# Altium schematic sheet Sheet2.SchDoc
size A3
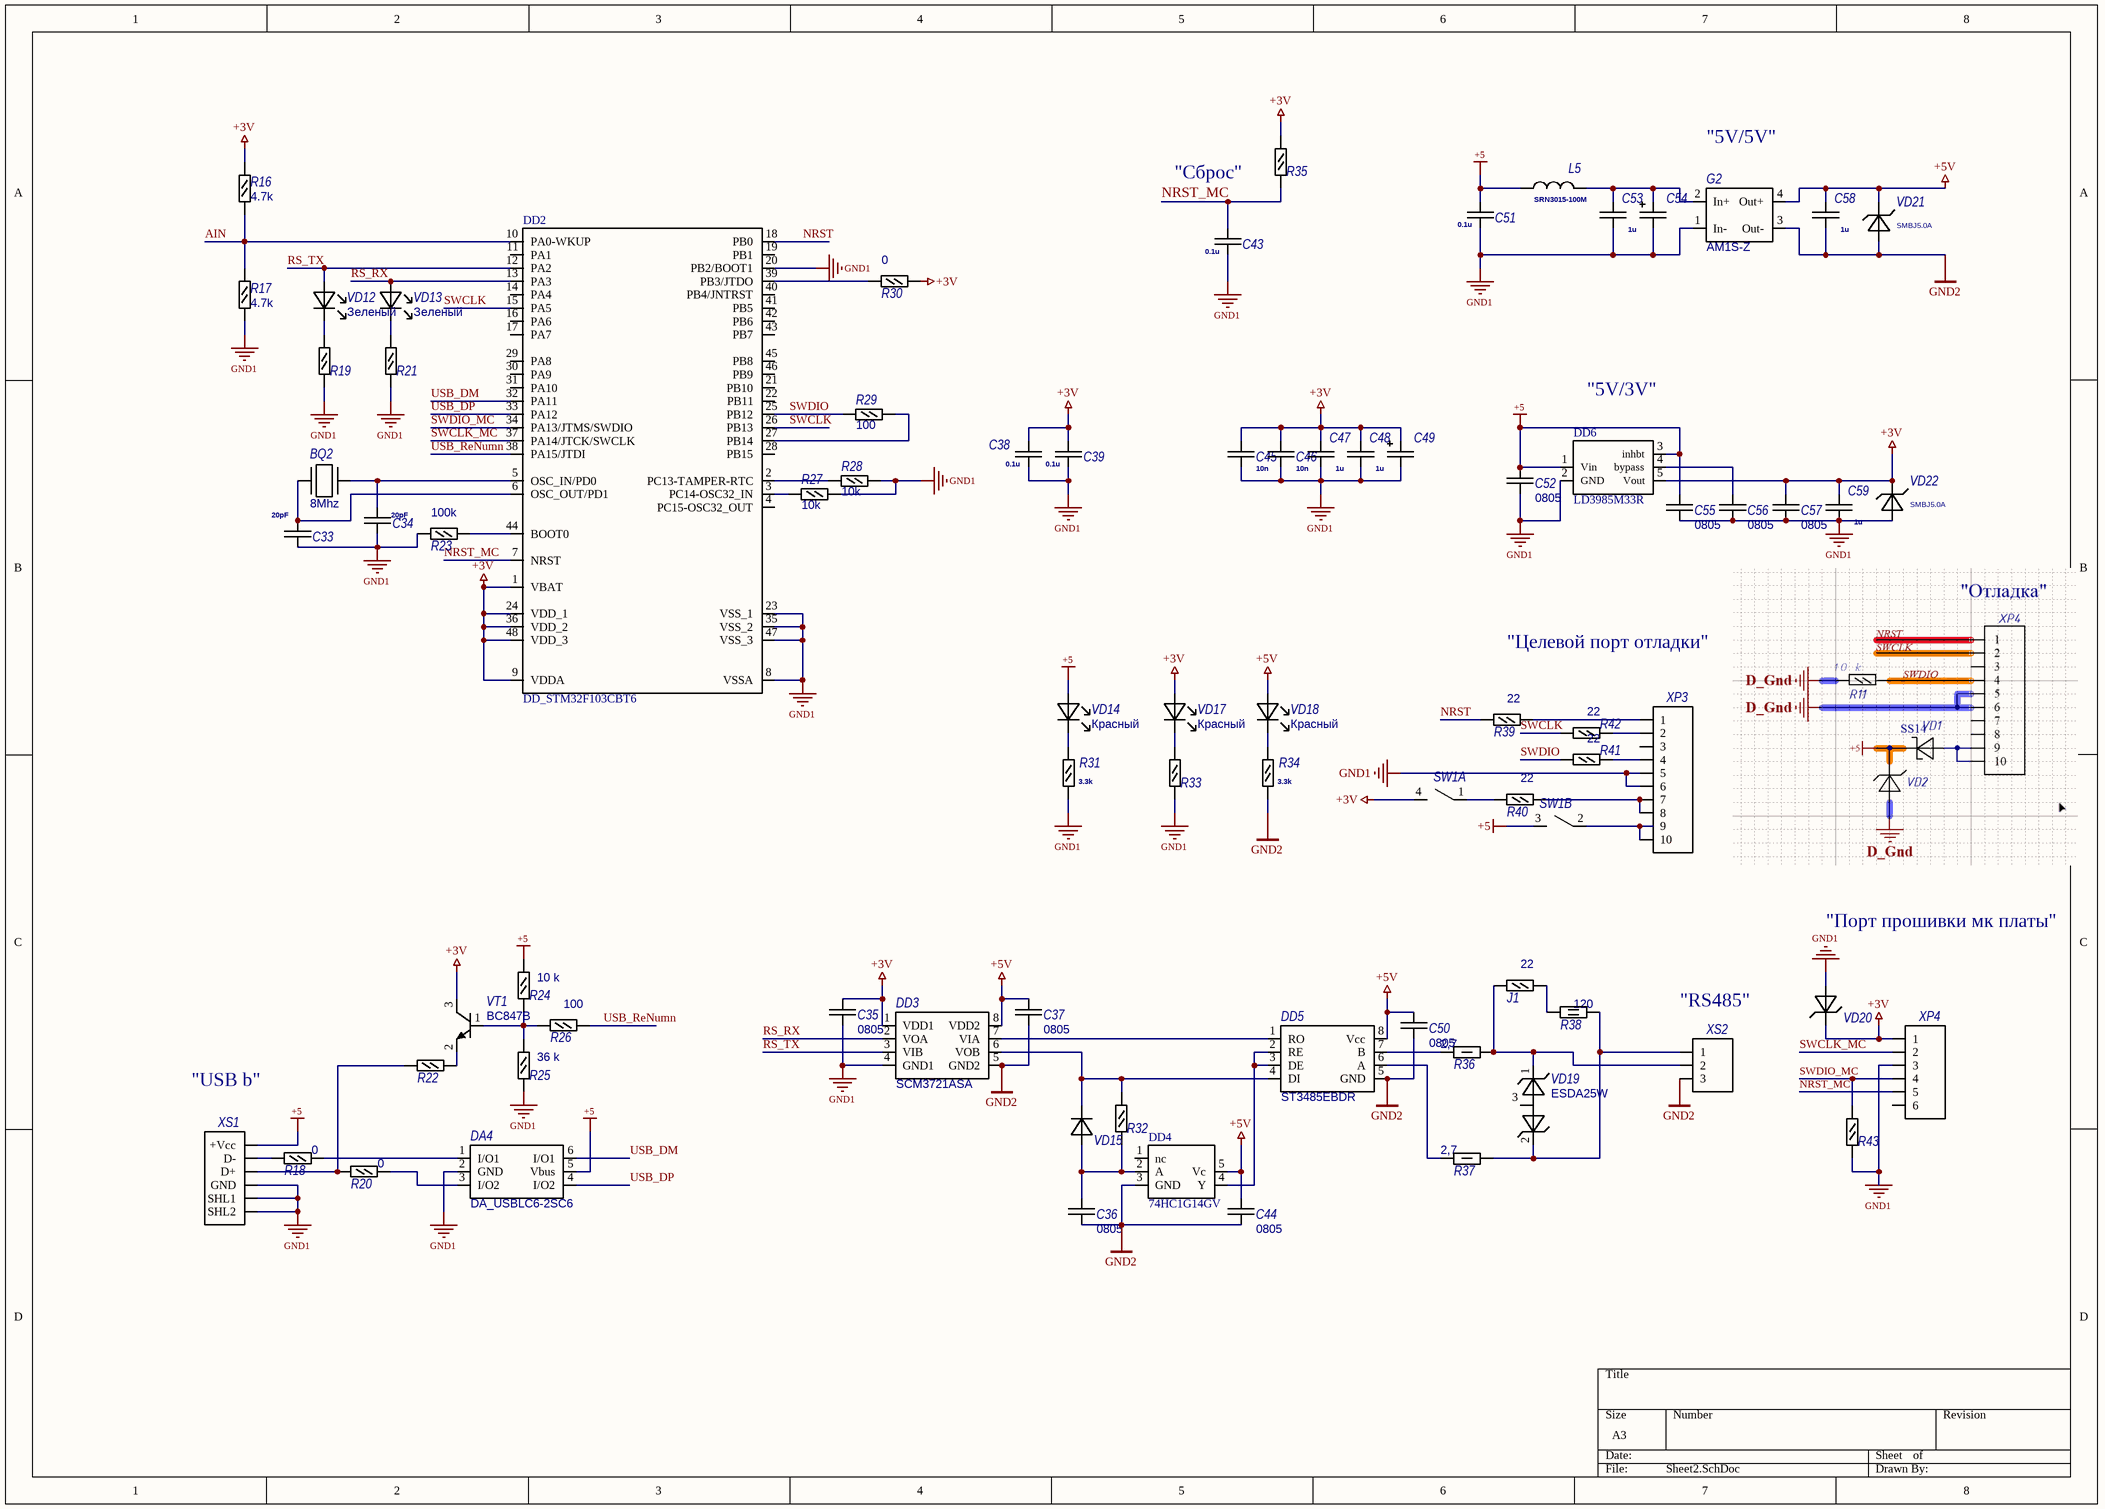
[diagram p0: Sheet2.SchDoc]

## Parts
BQ2  8Mhz  [Xtal]
C33  Номинал: 20pF  [CAP_0805_(2x1.25x1.3)]
C34  Номинал: 20pF  [CAP_0805_(2x1.25x1.3)]
C35  0805  [CAP_0805_(2x1.25x1.3)]
C36  0805  [CAP_0805_(2x1.25x1.3)]
C37  0805  [CAP_0805_(2x1.25x1.3)]
C38  0.1u  [CAP_0805_(2x1.25x1.3)]
C39  0.1u  [CAP_0805_(2x1.25x1.3)]
C43  0.1u  [CAP_0805_(2x1.25x1.3)]
C44  0805  [CAP_0805_(2x1.25x1.3)]
C45  10n  [CAP_0805_(2x1.25x1.3)]
C46  10n  [CAP_0805_(2x1.25x1.3)]
C47  1u  [CAP_0805_(2x1.25x1.3)]
C48  1u  [CAP_0805_(2x1.25x1.3)]
C49  TAN_A  [CAP_TAN_B]  (value not drawn)
C50  0805  [CAP_0805_(2x1.25x1.3)]
C51  0.1u  [CAP_0805_(2x1.25x1.3)]
C52  0805  [CAP_0805_(2x1.25x1.3)]
C53  1u  [CAP_0805_(2x1.25x1.3)]
C54  TAN_A  [CAP_TAN_B]  (value not drawn)
C55  0805  [CAP_0805_(2x1.25x1.3)]
C56  0805  [CAP_0805_(2x1.25x1.3)]
C57  0805  [CAP_0805_(2x1.25x1.3)]
C58  1u  [CAP_0805_(2x1.25x1.3)]
C59  1u  [CAP_0805_(2x1.25x1.3)]
DA4  DA_USBLC6-2SC6  [SOT-23-6L]
DD2  DD_STM32F103CBT6  [LQFP_48]
DD3  SCM3721ASA  [SOP-8]
DD4  74HC1G14GV  [sot-23-5]
DD5  ST3485EBDR  [SO-8_(0.15')]
DD6  LD3985M33R  [sot-23-5]
G2  AM1S-Z  [AM1S-Z]
J1  Номинал: 22  [RES_0805_(2x1.2x0.45)_0.125Вт]  (hidden comment: 0805)
L5  SRN3015-100M  [L_SRN3015]
R16  Номинал: 4.7k  [RES_0805_(2x1.2x0.45)_0.125Вт]  (hidden comment: 0805)
R17  Номинал: 4.7k  [RES_0805_(2x1.2x0.45)_0.125Вт]  (hidden comment: 0805)
R18  Номинал: 0  [RES_0805_(2x1.2x0.45)_0.125Вт]  (hidden comment: 0805)
R19  0805  [RES_0805_(2x1.2x0.45)_0.125Вт]  (value not drawn)
R20  Номинал: 0  [RES_0805_(2x1.2x0.45)_0.125Вт]  (hidden comment: 0805)
R21  0805  [RES_0805_(2x1.2x0.45)_0.125Вт]  (value not drawn)
R22  0805  [RES_0805_(2x1.2x0.45)_0.125Вт]  (value not drawn)
R23  Номинал: 100k  [RES_0805_(2x1.2x0.45)_0.125Вт]  (hidden comment: 0805)
R24  Номинал: 10 k  [RES_0805_(2x1.2x0.45)_0.125Вт]  (hidden comment: 0805)
R25  Номинал: 36 k  [RES_0805_(2x1.2x0.45)_0.125Вт]  (hidden comment: 0805)
R26  Номинал: 100  [RES_0805_(2x1.2x0.45)_0.125Вт]  (hidden comment: 0805)
R27  Номинал: 10k  [RES_0805_(2x1.2x0.45)_0.125Вт]  (hidden comment: 0805)
R28  Номинал: 10k  [RES_0805_(2x1.2x0.45)_0.125Вт]  (hidden comment: 0805)
R29  Номинал: 100  [RES_0805_(2x1.2x0.45)_0.125Вт]  (hidden comment: 0805)
R30  Номинал: 0  [RES_0805_(2x1.2x0.45)_0.125Вт]  (hidden comment: 0805)
R31  3.3k  [RES_0805_(2x1.2x0.45)_0.125Вт]
R32  0805  [RES_0805_(2x1.2x0.45)_0.125Вт]  (value not drawn)
R33  0805  [RES_0805_(2x1.2x0.45)_0.125Вт]  (value not drawn)
R34  3.3k  [RES_0805_(2x1.2x0.45)_0.125Вт]
R35  0805  [RES_0805_(2x1.2x0.45)_0.125Вт]  (value not drawn)
R36  Номинал: 2,7  [RES_1210_(3.2x2.5x0.55)_0.5Вт]  (hidden comment: 1210)
R37  Номинал: 2,7  [RES_1210_(3.2x2.5x0.55)_0.5Вт]  (hidden comment: 1210)
R38  Номинал: 120  [RES_2512_(6.3x3.1x0.6)_2Вт]  (hidden comment: 2512)
R39  Номинал: 22  [RES_0805_(2x1.2x0.45)_0.125Вт]  (hidden comment: 0805)
R40  Номинал: 22  [RES_0805_(2x1.2x0.45)_0.125Вт]  (hidden comment: 0805)
R41  Номинал: 22  [RES_0805_(2x1.2x0.45)_0.125Вт]  (hidden comment: 0805)
R42  Номинал: 22  [RES_0805_(2x1.2x0.45)_0.125Вт]  (hidden comment: 0805)
R43  0805  [RES_0805_(2x1.2x0.45)_0.125Вт]  (value not drawn)
SW1  SW_2_pin  [SW_DS1040_2pin]  (value not drawn)  (parts A,B of 2)
VD12  Примечания: Зеленый  [led_0805]  (hidden comment: VD_Led_0805)
VD13  Примечания: Зеленый  [led_0805]  (hidden comment: VD_Led_0805)
VD14  Примечания: Красный  [led_0805]  (hidden comment: VD_Led_0805)
VD15  VD  [VD_SMA_(Do-214AC)]  (value not drawn)
VD17  Примечания: Красный  [led_0805]  (hidden comment: VD_Led_0805)
VD18  Примечания: Красный  [led_0805]  (hidden comment: VD_Led_0805)
VD19  ESDA25W  [SOT-323-3L]
VD20  ESD  [VD_SOD523]  (value not drawn)
VD21  SMBJ5.0A  [VD_SMB_(Do-214AA)]
VD22  SMBJ5.0A  [VD_SMB_(Do-214AA)]
VT1  BC847B  [SOT-23]
XP3  XP_5x2_H  [XP_5x2_PIN_H]  (value not drawn)
XP4  XP_6_pin  [XP_6_Pin]  (value not drawn)
XS1  XS_USB_B  [XS_USBB]  (value not drawn)
XS2  XS_3_pin_2.54  [XS_KLS-2.54-03P]  (value not drawn)

## Nets
+3V: C35.2 C38.2 C39.2 C45.1 C46.1 C47.1 C48.1 C49.1 C57.2 C59.1 DD2.1(VBAT) DD2.9(VDDA) DD2.24(VDD_1) DD2.36(VDD_2) DD2.48(VDD_3) DD3.1(VDD1) DD6.5(Vout) R16.2 R30.1 R35.1 SW1.4 VD17.1(A) VD20.2(K) VD22.2(K) VT1.3(C) XP4.1
+5: C51.2 C52.2 C55.2 DA4.5(Vbus) DD6.1(Vin) DD6.3(inhbt) L5.1 R24.2 SW1.3 VD14.1(A) XS1.1(+Vcc)
+5V: C37.2 C44.2 C50.2 C58.1 DD3.8(VDD2) DD4.5(Vc) DD5.8(Vcc) G2.4(Out+) VD18.1(A) VD21.2(K)
GND1: C33.1 C34.1 C35.1 C38.1 C39.1 C43.1 C45.2 C46.2 C47.2 C48.2 C49.2 C51.1 C52.1 C53.2 C54.2 C55.1 C56.1 C57.1 C59.2 DA4.2(GND) DD2.8(VSSA) DD2.20(PB2/BOOT1) DD2.23(VSS_1) DD2.35(VSS_2) DD2.47(VSS_3) DD3.4(GND1) DD6.2(GND) G2.1(In-) R17.1 R19.1 R21.1 R23.2 R25.1 R27.2 R28.2 R31.1 R33.1 R43.2 VD20.1(A) VD22.1(A) XP3.5 XP3.6 XP4.3 XS1.4(GND) XS1.5(SHL1) XS1.6(SHL2)
GND2: C36.1 C37.1 C44.1 C50.1 C58.2 DD3.5(GND2) DD4.3(GND) DD5.5(GND) G2.3(Out-) R34.1 VD21.1(A) XS2.3
AIN: DD2.10(PA0-WKUP) R16.1 R17.2
NRST: DD2.18(PB0) R39.2
NRST_MC: C43.2 DD2.7(NRST) R35.2 XP4.5
RS_RX: DD2.13(PA3) DD3.2(VOA) VD13.1(A)
RS_TX: DD2.12(PA2) DD3.3(VIB) VD12.1(A)
SWCLK: DD2.15(PA5) DD2.26(PB13) R42.2
SWCLK_MC: DD2.37(PA14/JTCK/SWCLK) XP4.2
SWDIO: DD2.25(PB12) R29.1 R41.2
SWDIO_MC: DD2.34(PA13/JTMS/SWDIO) R43.1 XP4.4
USB_DM: DA4.6(I/O1) DD2.32(PA11)
USB_DP: DA4.4(I/O2) DD2.33(PA12)
USB_ReNumn: DD2.38(PA15/JTDI) R26.1
NetBQ2_1: BQ2.1 C34.2 DD2.5(OSC_IN/PD0)
NetBQ2_2: BQ2.2 C33.2 DD2.6(OSC_OUT/PD1)
NetC36_2: C36.2 DD4.2(A) R32.2 VD15.1(A)
NetC53_1: C53.1 C54.1 G2.2(In+) L5.2
NetC56_2: C56.2 DD6.4(bypass)
NetDA4_1: DA4.1(I/O1) R18.1
NetDA4_3: DA4.3(I/O2) R20.1
NetDD2_2: DD2.2(PC13-TAMPER-RTC) R28.1
NetDD2_3: DD2.3(PC14-OSC32_IN) R27.1
NetDD2_27: DD2.27(PB14) R29.2
NetDD2_39: DD2.39(PB3/JTDO) R30.2
NetDD2_44: DD2.44(BOOT0) R23.1
NetDD3_6: DD3.6(VOB) DD5.4(DI) R32.1 VD15.2(K)
NetDD3_7: DD3.7(VIA) DD5.1(RO)
NetDD4_4: DD4.4(Y) DD5.2(RE) DD5.3(DE)
NetDD5_6: DD5.6(A) R37.1
NetDD5_7: DD5.7(B) R36.1
NetJ1_1: J1.1 R38.1
NetJ1_2: J1.2 R36.2 VD19.1 XS2.2
NetR18_2: R18.2 XS1.2(D-)
NetR19_2: R19.2 VD12.2(K)
NetR20_2: R20.2 R22.2 XS1.3(D+)
NetR21_2: R21.2 VD13.2(K)
NetR22_1: R22.1 VT1.2(E)
NetR24_1: R24.1 R25.2 R26.2 VT1.1(B)
NetR31_2: R31.2 VD14.2(K)
NetR33_2: R33.2 VD17.2(K)
NetR34_2: R34.2 VD18.2(K)
NetR37_2: R37.2 R38.2 VD19.2 XS2.1
NetR39_1: R39.1 XP3.1
NetR40_1: R40.1 XP3.7 XP3.8
NetR40_2: R40.2 SW1.1
NetR41_1: R41.1 XP3.4
NetR42_1: R42.1 XP3.2
NetSW1_2: SW1.2 XP3.9 XP3.10

Not connected (* = marked no-connect by the designer): DD2 4(PC15-OSC32_OUT) 11(PA1) 14(PA4) 16(PA6) 17(PA7) 19(PB1) 21(PB10) 22(PB11) 28(PB15) 29(PA8) 30(PA9) 31(PA10) 40(PB4/JNTRST) 41(PB5) 42(PB6) 43(PB7) 45(PB8) 46(PB9); DD4 1(nc); VD19 3; XP3 3; XP4 6

## Notes on the sheet
- "Сброс"
- "5V/5V"
- (near DD6) "5V/3V"
- "Целевой порт отладки"
- "Порт прошивки мк платы"
- (near XS2) "RS485"
- "USB b"

## Library data of the parts
BQ2 = Xtal: Наименование: 8.00M-HC49-S
C33 C34 = C_0805: Керамика; Тип: Конденсатор; Корпус: 0805; Напряжение: 50 В
C35 C37 C44 C50 = C_0805: Керамика; Тип: Конденсатор; Наименование: VJ0805Y104KXACW1BC; Номинал: 0.1uF; Корпус: 0805
C36 = C_0805: Керамика; Тип: Конденсатор; Наименование: GRM216R71H102K; Номинал: 1nF; Корпус: 0805
C38 C39 C43 C51 = C_0805: Керамика; Тип: Конденсатор; Корпус: 0805; Наименование: VJ0805Y104KXACW1BC; Напряжение: 50 В; Номинал: 0.1u; Идентификатор: VJ0805Y104KXACW1BC
  C38: Примечания: VJ0805Y104KXACW1BC
C45 C46 = C_0805: Керамика; Тип: Конденсатор; Корпус: 0805; Наименование: CC0805JRX7R9BB103; Напряжение: 50 В; Номинал: 10n; Идентификатор: CC0805JRX7R9BB103
C47 C48 = C_0805: Керамика; Тип: Конденсатор; Корпус: 0805; Наименование: CC0805JRX7R9BB103; Напряжение: 50 В; Идентификатор: CC0805JKX7R9BB105; Номинал: 1u
C49 C54 = C+_TAN_B: Capacitor; Тип: Конденсатор танталовый; Корпус: A; Наименование: 293D226X9010A2TE3; Напряжение: 10 В; Номинал: 22u; Идентификатор: 293D226X9010A2TE3
C52 = C_0805: Керамика; Тип: Конденсатор; Наименование: CC0805JKX7R9BB105; Номинал: 1uF; Корпус: 0805
C53 C58 C59 = C_0805: Керамика; Тип: Конденсатор; Корпус: 0805; Наименование: CC0805JKX7R9BB105; Напряжение: 50 В; Номинал: 1u; Идентификатор: CC0805JKX7R9BB105
C55 C57 = C_0805: Керамика; Тип: Конденсатор; Наименование: VJ0805Y104KXACW1BC; Номинал: 100nF; Корпус: 0805
C56 = C_0805: Керамика; Тип: Конденсатор; Наименование: CC0805JRX7R9BB103; Номинал: 10nF; Корпус: 0805
DA4 = DA_USBLC6-2SC6: USB ESD protector SOT23-6; Тип: ESD protector; Корпус: SOT23-6; Наименование: USBLC6-2SC6; Идентификатор: USBLC6-2SC6
DD2 = DD_STM32F103CBT6: STM32 ARM-based 32-bit MCU with 128 Kbytes Flash, 48-pin LQFP, Industrial Temperature; Published: 30-May-2008; DatasheetVersion: rev6, Mar-2008; PackageVersion: Mar-2008; PackageReference: LQFP48; Publisher: Altium Limited; PackageDescription: 48-Pin Low-Profile Quad Flat Pack, 7 x 7 mm Body, 0.5 mm Pitch (LQFP48); ComponentLink1Description: Manufacturer Link; ComponentLink1URL: www.st.com/stm32; ComponentLink2Description: Datasheet; ComponentLink2URL: http://www.st.com/stonline/products/literature/ds/13587.pdf; Наименование: STM32F103CBT6
DD3 = DD_SCM3721ASA: Dual-ChannelDigital Isolators; Тип: SCM3721ASA; Наименование: SCM3721ASA; Идентификатор: SCM3721ASA
DD4 = DD_74HC1G14GV: 1 канал инвертирующ триггер шмитта; Parameter 1: 74HC1G14GV; Наименование: 74HC1G14GV
DD5 = DD_ST3485EBDR: RS485/422 Приемопередатчик интерфейса; Тип: ST3485EBDR; Наименование: ST3485EBDR
DD6 = DD_LD3985M33R: Источник опорного напряжения 3.3В; Parameter 1: 74HC1G14GV; Наименование: LD3985M33R
G2 = G_AM1S-Z: DC/DC; Тип: Источник питания DC/DC; Наименование: B0505S-1WR3; Напряжение: 5 В; Идентификатор: B0505S-1WR3
J1 R39-R42 = R_0805: Resistor; Тип: Резистор; Наименование: RC0805JR-0722RL; Корпус: 0805; Идентификатор: -
L5 = L_SRN3015: L; Тип: Индуктивность; Номинал: 10 мкГн, 1 А; Наименование: SRN3015-100M; Идентификатор: SRN3015-100M
R16 R17 = R_0805: Resistor; Тип: Резистор; Наименование: RC0805JR-074K7L; Корпус: 0805; Идентификатор: -
R18 R20 R30 = R_0805: Resistor; Тип: Резистор; Наименование: RC0805JR-070RL; Корпус: 0805
  R18 R20: Идентификатор: RC0805JR-070RL
  R30: Идентификатор: -
R19 R21 R22 R33 = R_0805: Resistor; Тип: Резистор; Наименование: RC0805JR-071K5L; Номинал: 1.5 k; Корпус: 0805; Идентификатор: RC0805JR-071K5L
R23 = R_0805: Resistor; Тип: Резистор; Наименование: RC0805JR-07100KL; Корпус: 0805; Идентификатор: -
R24 R27 R28 = R_0805: Resistor; Тип: Резистор; Наименование: RC0805JR-0710KL; Корпус: 0805; Идентификатор: -
R25 = R_0805: Resistor; Тип: Резистор; Наименование: RC0805JR-0736KL; Корпус: 0805; Идентификатор: RC0805JR-0736KL
R26 R29 = R_0805: Resistor; Тип: Резистор; Наименование: RC0805JR-07100RL; Корпус: 0805; Идентификатор: -
R31 R34 = R_0805: Resistor; Тип: Резистор; Корпус: 0805; Наименование: RC0805JR-073K3L; Идентификатор: RC0805JR-073K3L
  R31: Номинал: 3.3k
  R34: Номинал: 3.3 k
R32 = R_0805: Resistor; Тип: Резистор; Наименование: RC0805JR-0722KL; Номинал: 22k; Корпус: 0805
R35 R43 = R_0805: Resistor; Тип: Резистор; Наименование: RC0805JR-0710KL; Номинал: 10 k; Корпус: 0805; Идентификатор: RC0805JR-0710KL
R36 R37 = R_1210: Resistor; Тип: Резистор; Наименование: RC1210JR-072R7L; Корпус: 1210
R38 = R_2512: Тип: Резистор; Наименование: RC2512JR-07120RL; Корпус: 2512
SW1 = SW_2_pin: Наименование: DS1040-02RN; Идентификатор: DS1040-02RN
VD12 VD13 = VD_Led_0805: Тип: Светодиод (Зеленый); Корпус: 0805; Наименование: BL-LS0805PGC; Идентификатор: BL-LS0805PGC
VD14 VD17 VD18 = VD_Led_0805: Тип: Светодиод (Красный); Корпус: 0805; Наименование: BL-LS0805UHR; Идентификатор: BL-LS0805UHR
VD15 = VD: Diode; Наименование: 1N4148; Идентификатор: 1N4148
VD19 = VD_ESDA25W: Защитный биполярный диод; Корпус: SOT323; Тип: ESDA25W; Наименование: ESDA25W
VD20 = VD_ESD: Защитный диод; Корпус: SOD523; Наименование: ESD5Z3.3T1G; Напряжение: 3.3 В; Тип: Защитный диод; Идентификатор: ESD5Z3.3T1G
VD21 VD22 = VD_SMBJ50A: Защитный диод 600W 5V 5% [SMB]; Корпус: SMB; Напряжение: 5 В; Тип: Защитный диод; Наименование: SMBJ50A; Идентификатор: SMBJ5.0A
VT1 = VT_BC847B: NPN Bipolar Transistor; Наименование: BC847B; Идентификатор: BC847B
XP3 = XP_5x2_H: Наименование: BH10R
XP4 = XP_6_pin: Тип: Вилка штырьевая (2.54); Наименование: PLS-6; Идентификатор: PLS-6
XS1 = XS_USB_B: Наименование: USB-B
XS2 = XS_3_pin_2.54: Наименование: DG308-2.54-03P; Идентификатор: DG308-2.54-03P